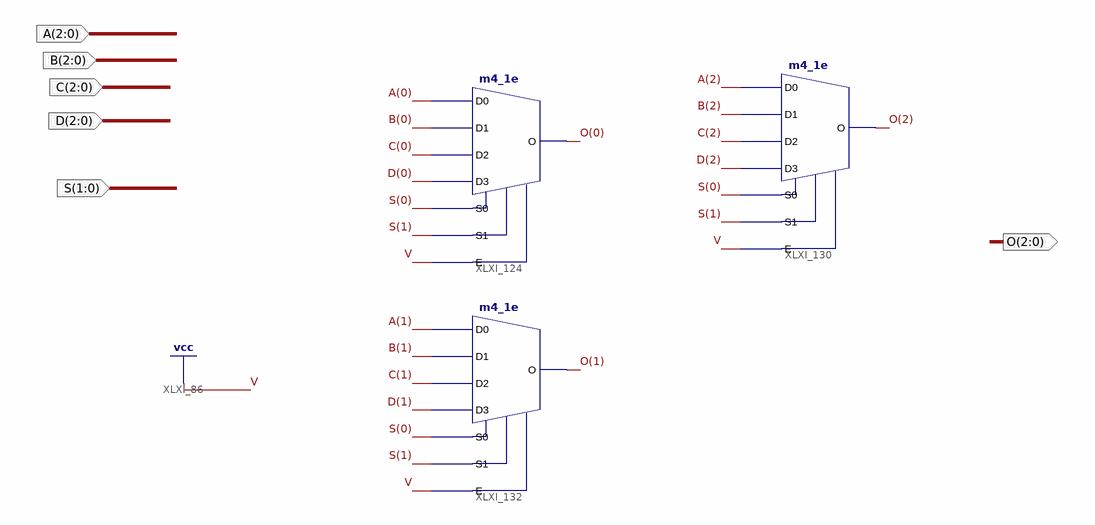
[diagram p0: schematic sheet 1]
// Xilinx ISE schematic mux3b4.sch (artix7) as structural Verilog: 3 symbols, 6 ports
module mux3b4 (
  input  [2:0] A,
  input  [2:0] B,
  input  [2:0] C,
  input  [2:0] D,
  input  [1:0] S,
  output [2:0] O
);

  m4_1e XLXI_124 (.D0(A[0]), .D1(B[0]), .D2(C[0]), .D3(D[0]), .E(1'b1), .S0(S[0]), .S1(S[1]), .O(O[0]));
  m4_1e XLXI_130 (.D0(A[2]), .D1(B[2]), .D2(C[2]), .D3(D[2]), .E(1'b1), .S0(S[0]), .S1(S[1]), .O(O[2]));
  m4_1e XLXI_132 (.D0(A[1]), .D1(B[1]), .D2(C[1]), .D3(D[1]), .E(1'b1), .S0(S[0]), .S1(S[1]), .O(O[1]));
endmodule
